# EAGLE design audio3 (EAGLE 6.4)
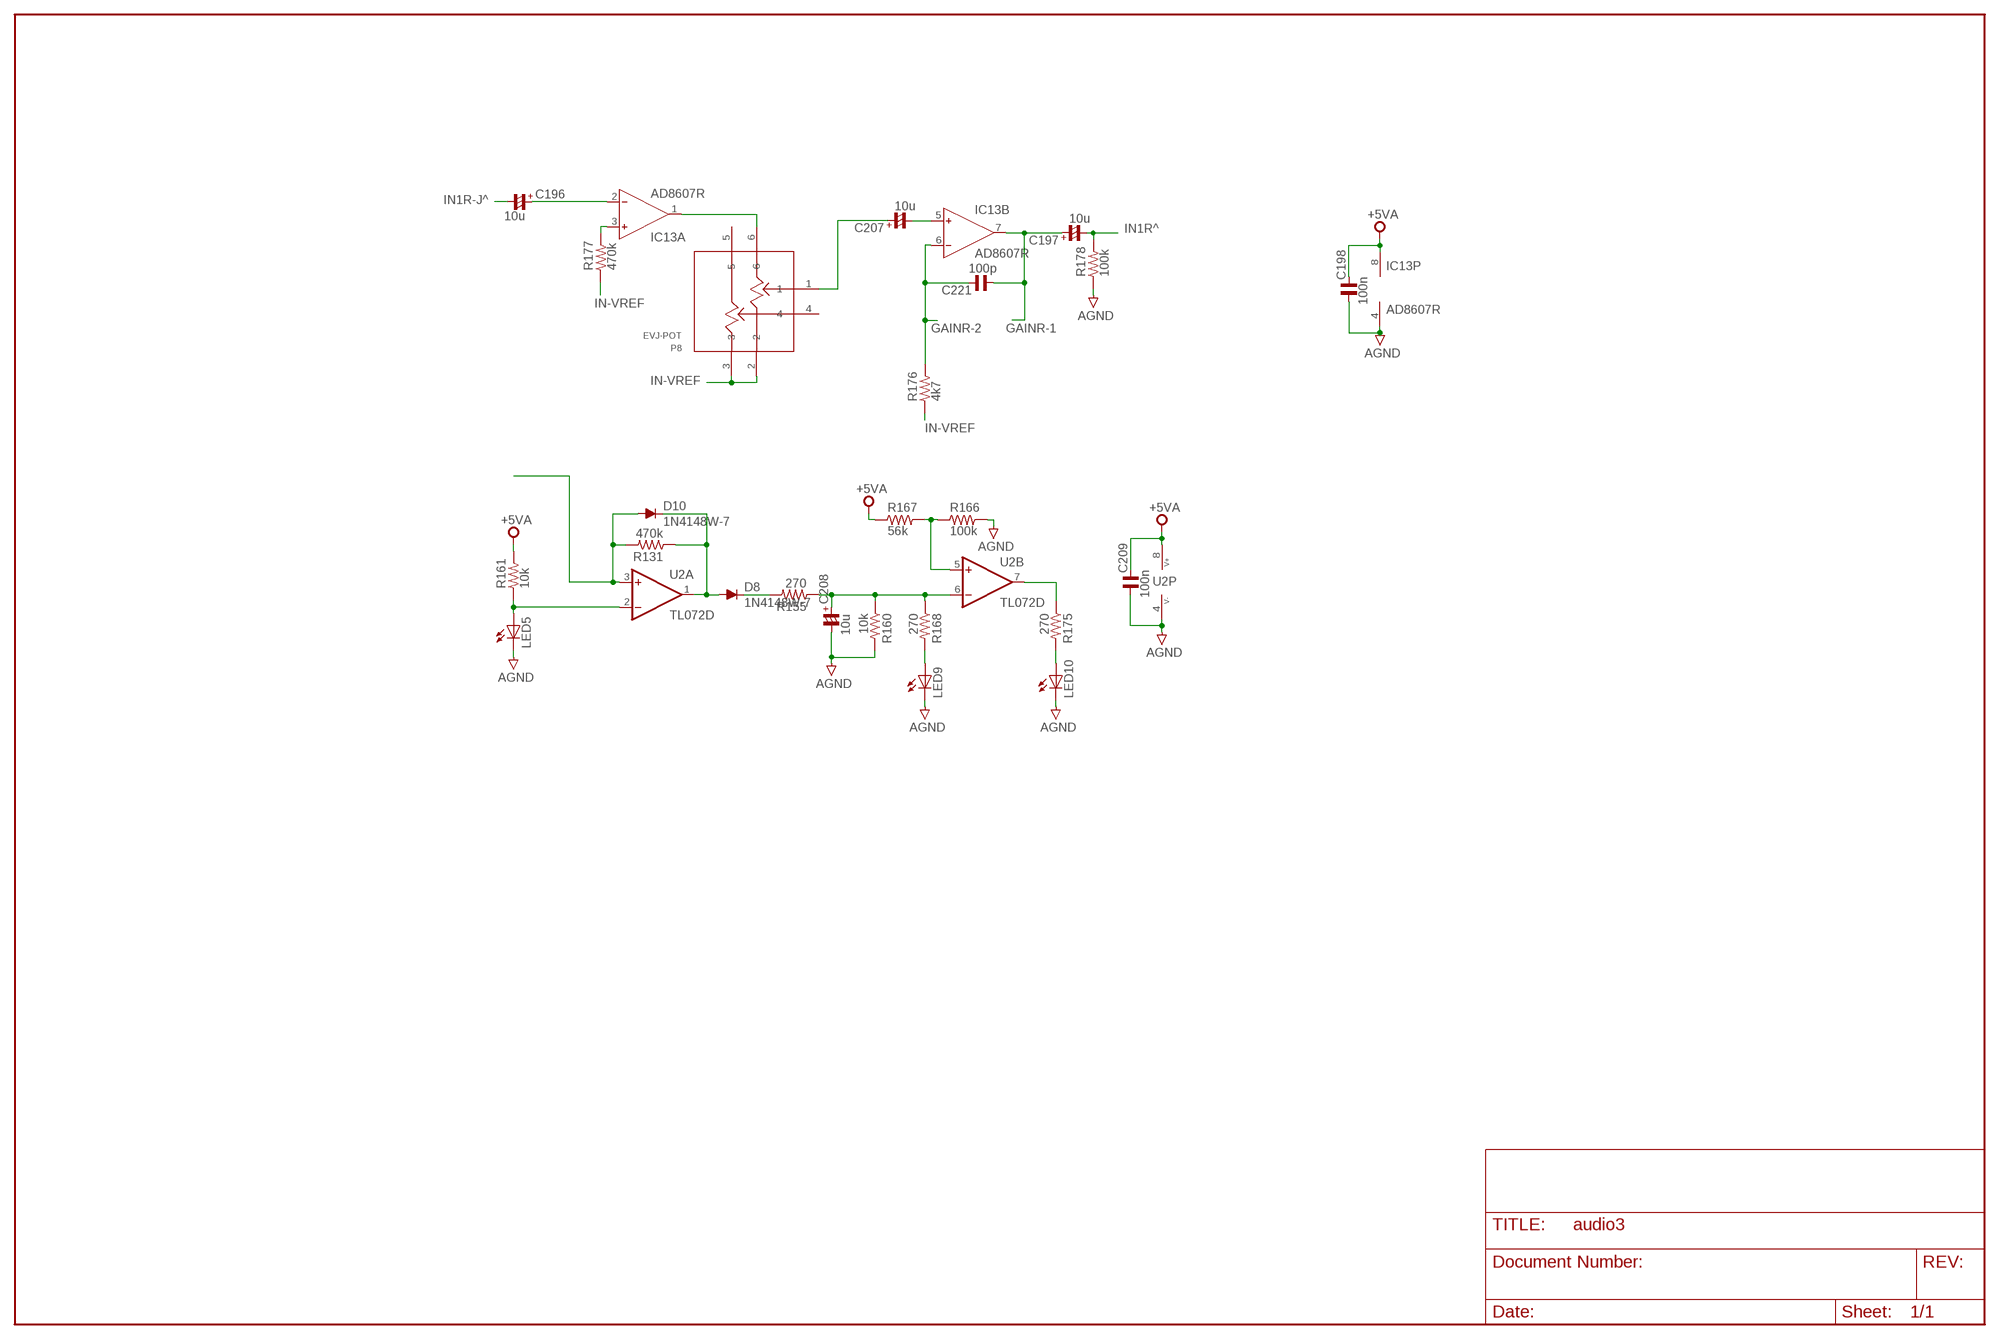
[diagram p0: schematic, sheet 1]

## Parts
C196  10u  CP_1206/T  [C1206/T]
C197  10u  CP_1206/T  [C1206/T]
C198  100n  C_0603  [C0603]
C207  10u  CP_1206/T  [C1206/T]
C208  10u  CP_1206/T  [C1206/T]
C209  100n  C_0603  [C0603]
C221  100p  C_0603  [C0603]
D8  1N4148W-7  [SOD123]
D10  1N4148W-7  [SOD123]
IC13  AD8607R  [SO8]
LED5  LEDCHIPLED_0805  [CHIPLED_0805]
LED9  LEDCHIPLED_0805  [CHIPLED_0805]
LED10  LEDCHIPLED_0805  [CHIPLED_0805]
P8  EVJ-POT  [EVJ-POT]
R131  470k  R_0603  [R0603]
R155  270  R_0603  [R0603]
R160  10k  R_0603  [R0603]
R161  10k  R_0603  [R0603]
R166  100k  R_0603  [R0603]
R167  56k  R_0603  [R0603]
R168  270  R_0603  [R0603]
R175  270  R_0603  [R0603]
R176  4k7  R_0603  [R0603]
R177  470k  R_0603  [R0603]
R178  100k  R_0603  [R0603]
U2  TL072D  [SO08]

## Nets
+5VA: C198.2 C209.2 IC13.8(P:V+) R161.2 R167.1 U2.8(P:V+)
AGND: C198.1 C208.- C209.1 IC13.4(P:V-) LED5.C LED9.C LED10.C R160.2 R166.2 R178.1 U2.4(P:V-)
GAINR-1: C197.+ C221.1 IC13.7(B:OUT)
GAINR-2: C221.2 IC13.6(B:IN-) R176.2
IN1R-J^: C196.-
IN1R^: C197.- R178.2
IN-VREF: P8.2 P8.3 R176.1 R177.1
N$153: IC13.3(A:IN+) R177.2
N$155: D10.A R131.2 U2.3(A:+IN)
N$158: IC13.1(A:OUT) P8.6
N$159: C207.- IC13.5(B:IN+)
N$162: D8.A D10.C R131.1 U2.1(A:OUT)
N$164: C196.+ IC13.2(A:IN-)
N$165: C207.+ P8.1
N$166: D8.C R155.2
N$167: C208.+ R155.1 R160.1 R168.1 U2.6(B:-IN)
N$168: LED5.A R161.1 U2.2(A:-IN)
N$173: LED9.A R168.2
N$174: LED10.A R175.2
N$178: R175.1 U2.7(B:OUT)
N$179: R166.1 R167.2 U2.5(B:+IN)
Unconnected: P8.4 P8.5

## Library data of the parts
C196 C197 C207 C208 = rc-master-smd:CP_: POLARIZED CAP
C198 C209 C221 = rc-master-smd:C_: NON-POLARIZED CAP
D8 D10 = diode:1N4148: DIODE high speed (Philips)
IC13 = analog-devices:AD8607: Precision Micropower, Low Noise CMOS, Rail-to-Rail Input/Output Operational Amplifiers Source: http://www.analog.com/static/imported-files/data_sheets/AD8603_8607_8609.pdf; MPN: AD8607ARMZ-R2; OC_FARNELL: 1651293; OC_NEWARK: 19M8927
LED5 LED9 LED10 = led:LED: LED OSRAM: - CHIPLED LG R971, LG N971, LY N971, LG Q971, LY Q971, LO R971, LY R971 LH N974, LH R974 LS Q976, LO Q976, LY Q976 LO Q996 - Hyper CHIPLED LW Q18S LB Q993, LB Q99A, LB R99A - SideLED LS A670, LO A670, LY A670, LG A670, LP A670 LB A673, LV A673, LT A673, LW A673 LH A674 LY A675 LS A676, LA A676, LO A676, LY A676, LW A676 LS A679, LY A679, LG A679 - Hyper Micro SIDELED® LS Y876, LA Y876, LO Y876, LY Y876 LT Y87S - SmartLED LW L88C, LW L88S LB L89C, LB L89S, LG L890 LS L89K, LO L89K, LY L89K LS L896, LA L896, LO L896, LY L896 - TOPLED LS T670, LO T670, LY T670, LG T670, LP T670 LSG T670, LSP T670, LSY T670, LOP T670, LYG T670 LG T671, LOG T671, LSG T671 LB T673, LV T673, LT T673, LW T673 LH T674 LS T676, LA T676, LO T676, LY T676, LB T676, LH T676, LSB T676, LW T676 LB T67C, LV T67C, LT T67C, LS T67K, LO T67K, LY T67K, LW E67C LS E67B, LA E67B, LO E67B, LY E67B, LB E67C, LV E67C, LT E67C LW T67C LS T679, LY T679, LG T679 LS T770, LO T770, LY T770, LG T770, LP T770 LB T773, LV T773, LT T773, LW T773 LH T774 LS E675, LA E675, LY E675, LS T675 LS T776, LA T776, LO T776, LY T776, LB T776 LHGB T686 LT T68C, LB T68C - Hyper Mini TOPLED® LB M676 - Mini TOPLED Santana® LG M470 LS M47K, LO M47K, LY M47K Source: http://www.osram.convergy.de LUXEON: - LUMILED® LXK2-PW12-R00, LXK2-PW12-S00, LXK2-PW14-U00, LXK2-PW14-V00 LXK2-PM12-R00, LXK2-PM12-S00, LXK2-PM14-U00 LXK2-PE12-Q00, LXK2-PE12-R00, LXK2-PE12-S00, LXK2-PE14-T00, LXK2-PE14-U00 LXK2-PB12-K00, LXK2-PB12-L00, LXK2-PB12-M00, LXK2-PB14-N00, LXK2-PB14-P00, LXK2-PB14-Q00 LXK2-PR12-L00, LXK2-PR12-M00, LXK2-PR14-Q00, LXK2-PR14-R00 LXK2-PD12-Q00, LXK2-PD12-R00, LXK2-PD12-S00 LXK2-PH12-R00, LXK2-PH12-S00 LXK2-PL12-P00, LXK2-PL12-Q00, LXK2-PL12-R00 Source: www.luxeon.com KINGBRIGHT: KA-3528ASYC Source: www.kingbright.com
P8 = monome-inc:EVJ-POT: audio pot
R131 R155 R160 R161 R166-R168 R175-R178 = rc-master-smd:R_: RESISTOR
U2 = linear:TL072: OP AMP

## Board
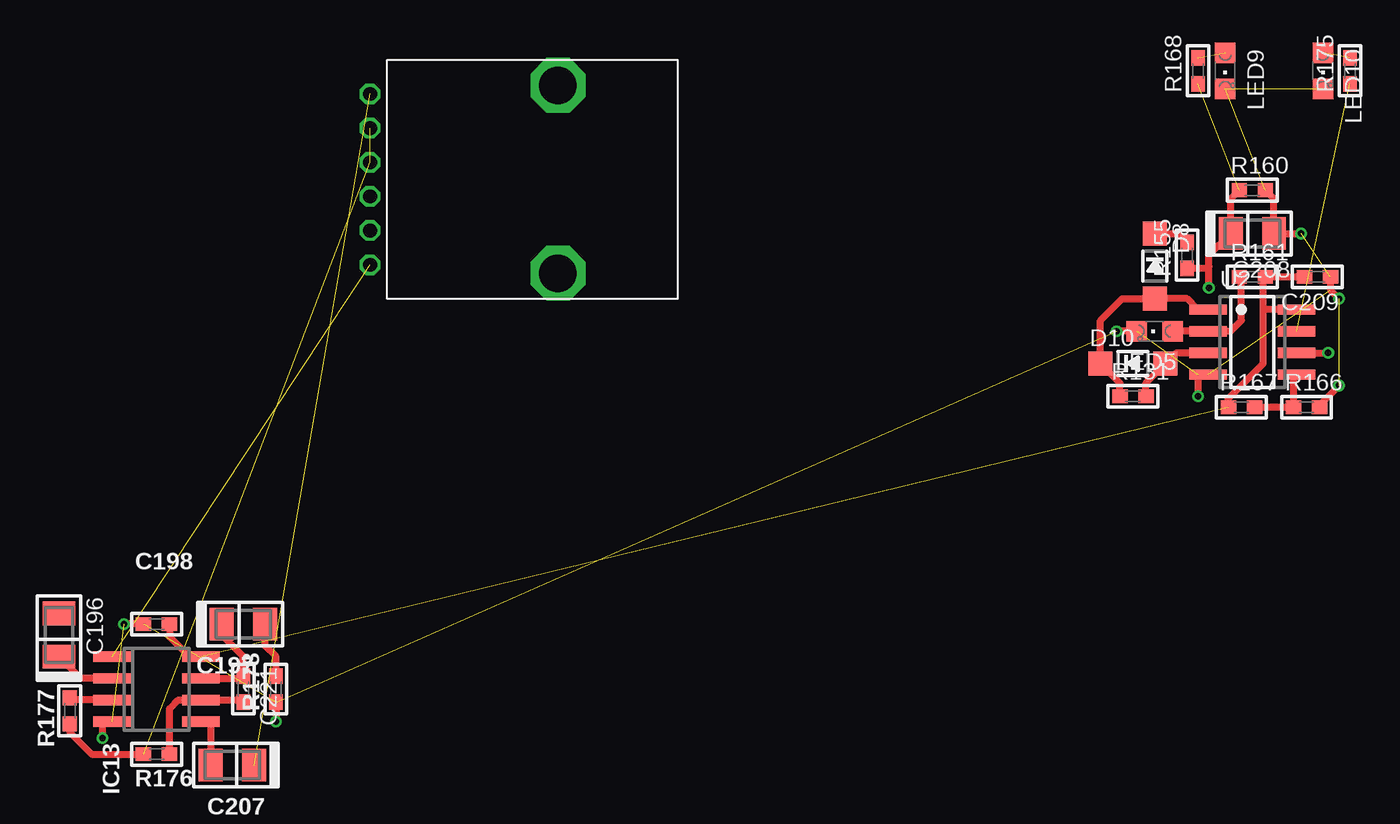
[diagram p1: board, top side]
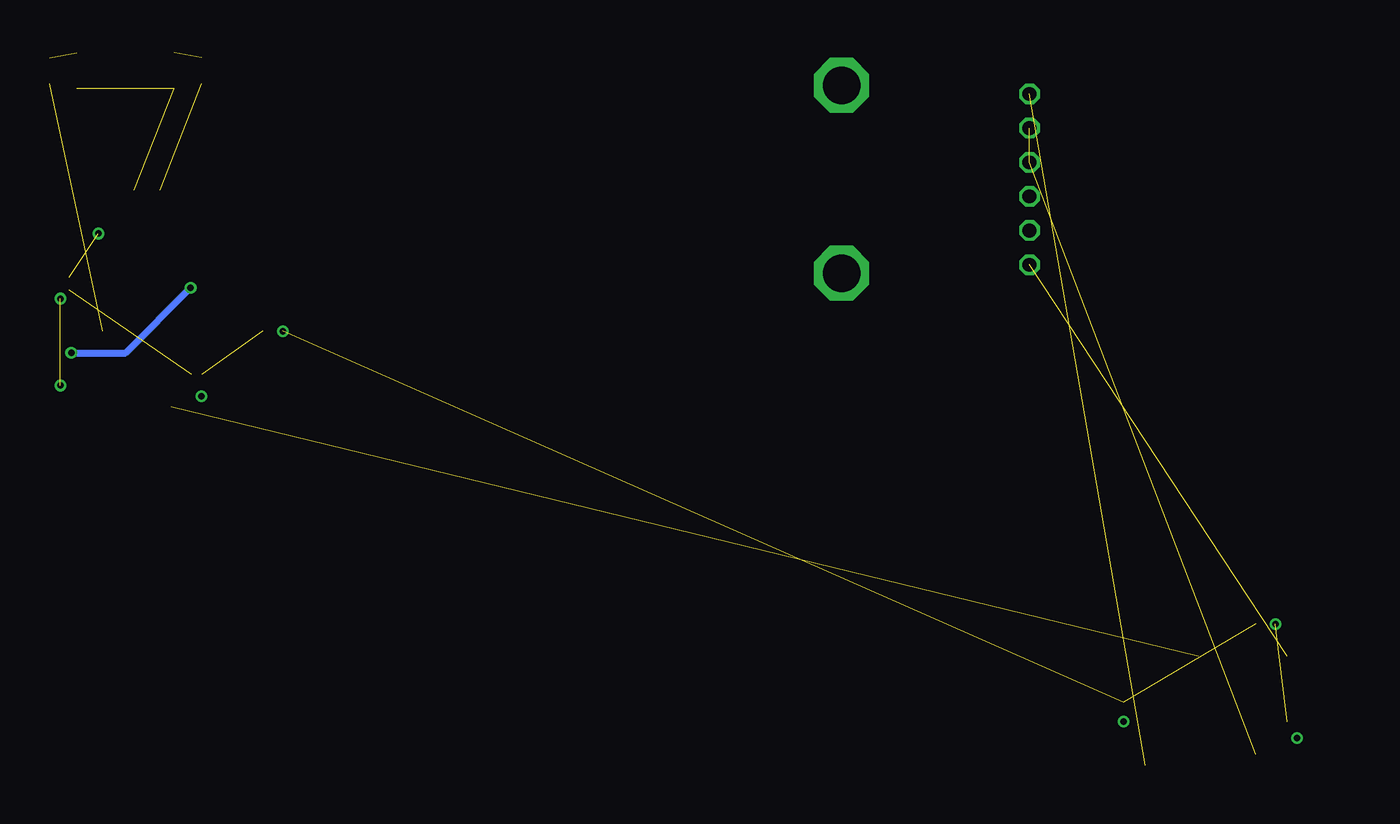
[diagram p2: board, bottom side, seen from below]

No outline drawn. Coordinates in mm, seen from the top.
Copper layers (1*2+3*16): Top 0.035mm / dielectric 1.5mm / power 0.035mm / dielectric 0.15mm / gnd 0.035mm / dielectric 0.2mm / Bottom 0.035mm
Design rules "default *": minimum track width 6mil, minimum drill 15mil, track to track 6mil, track to pad 6mil, pad to pad 6mil, via to via 6mil, smd to smd 6mil, copper to edge 10mil, drill to drill 8mil, minimum pad ring 6mil, minimum via ring 6mil, stop-mask expansion 4mil, vias tented up to drill 0mil, thermal gap 10mil

### Footprints (pad centres in the part's own frame; a part is rotated, then mirrored left to right if it is on the bottom)
C1206/T = smd 1.4 x 1.9: + 1.27,0; - -1.27,0
C0603 = smd 0.9 x 0.8: 1 -0.762,0; 2 0.762,0
SOD123 = smd 1.4 x 1.4: A 1.905,0; C -1.905,0
SO8 = smd 0.6 x 2.2: 1 -1.905,-2.6; 2 -0.635,-2.6; 3 0.635,-2.6; 4 1.905,-2.6; 5 1.905,2.6; 6 0.635,2.6; 7 -0.635,2.6; 8 -1.905,2.6
CHIPLED_0805 = smd 1.2 x 1.2: A 0,-1.05; C 0,1.05
EVJ-POT = drill 0.8 octagon: 1 -5,-11; 2 -3,-11; 3 -1,-11; 4 1,-11; 5 3,-11; 6 5,-11 | drill 2.2 octagon: M1 -5.5,0; M2 5.5,0
R0603 = smd 0.9 x 0.8: 1 -0.762,0; 2 0.762,0
SO08 = smd 0.6 x 2.2: 1 -1.905,-2.6; 2 -0.635,-2.6; 3 0.635,-2.6; 4 1.905,-2.6; 5 1.905,2.6; 6 0.635,2.6; 7 -0.635,2.6; 8 -1.905,2.6

### Placement (x,y rotation side)
C196  245.75,50.16 270 top
C197  256.54,50.8 180 top
C198  251.46,50.8 0 top
C207  255.91,42.55 0 top
C208  315.6,73.66 180 top
C209  319.4,71.12 180 top
C221  256.54,46.99 270 top
D8  309.88,71.75 270 top
D10  308.61,66.04 0 top
IC13  251.46,46.99 270 top
LED5  309.88,67.94 90 top
LED9  314.01,83.19 180 top
LED10  319.72,83.19 180 top
P8  274.95,76.83 270 top
R131  308.61,64.14 0 top
R155  311.79,72.39 90 top
R160  315.6,76.2 0 top
R161  315.6,71.12 0 top
R166  318.77,63.5 0 top
R167  314.96,63.5 0 top
R168  312.42,83.19 90 top
R175  321.31,83.19 90 top
R176  251.46,43.18 0 top
R177  246.38,45.72 90 top
R178  258.44,46.99 90 top
U2  315.6,67.31 270 top

### Tracks (layer width: path | path; a pad name or v marks a point on that pad's centre or on a via)
+5VA  (1 unrouted)
  Top 0.406: C198.2 252.22,50.04 253.37,48.9 IC13.8 | C209.2 R161.2 316.23,70.99 316.23,69.22 | R167.1 314.2,64.01 316.23,66.04 316.23,69.22 | U2.8 316.23,69.22
AGND  (via drill 0.38)  (9 unrouted)
  Top 0.406: IC13.4 248.28,45.09 v248.28,44.13 | C198.1 v249.56,50.8 | R178.1 v258.44,45.09 | U2.4 312.42,65.41 v312.42,64.14 | LED5.C v307.66,67.94 | C209.1 320.17,70.36 v320.68,69.85 | R160.2 316.87,75.69 C208.- v318.45,73.66 | R166.2 319.53,63.63 v320.68,64.77
GAINR-1
  Top 0.406: IC13.7 256.41,47.62 C221.1 256.54,48.9 255.27,50.16 C197.+
GAINR-2
  Top 0.406: C221.2 256.41,46.35 IC13.6 252.73,46.35 252.22,45.85 R176.2
IN1R^
  Top 0.406: R178.2 258.44,48.9 257.81,49.53 C197.-
IN-VREF  (2 unrouted)
  Top 0.406: R177.1 246.38,44.45 247.65,43.18 R176.1
N$153
  Top 0.406: IC13.3 246.51,46.35 R177.2
N$155
  Top 0.406: U2.3 311.15,66.67 D10.A 309.37,64.9 R131.2
N$158  (1 unrouted)
N$159
  Top 0.406: IC13.5 254.63,45.09 C207.-
N$162
  Top 0.406: U2.1 312.42,69.22 311.79,69.85 D8.A 307.98,69.85 306.7,68.58 D10.C 307.85,64.9 R131.1
N$164
  Top 0.406: IC13.2 247.01,47.62 C196.+
N$165  (1 unrouted)
N$166
  Top 0.406: D8.C 311.28,73.66 R155.2
N$167  (via drill 0.38)  (1 unrouted)
  Top 0.406: R160.1 314.32,75.69 C208.+ 313.06,72.39 313.06,71.75 | U2.6 v320.04,66.67 | v313.06,70.48 313.06,71.75 | R155.1 312.93,71.63 313.06,71.75
  Bottom 0.406: v320.04,66.67 316.87,66.67 v313.06,70.48
N$168
  Top 0.406: LED5.A U2.2 314.32,67.94 314.96,68.58 314.96,70.99 R161.1
N$173  (1 unrouted)
N$174  (1 unrouted)
N$178  (1 unrouted)
N$179
  Top 0.406: R167.2 R166.1 318.01,65.22 U2.5